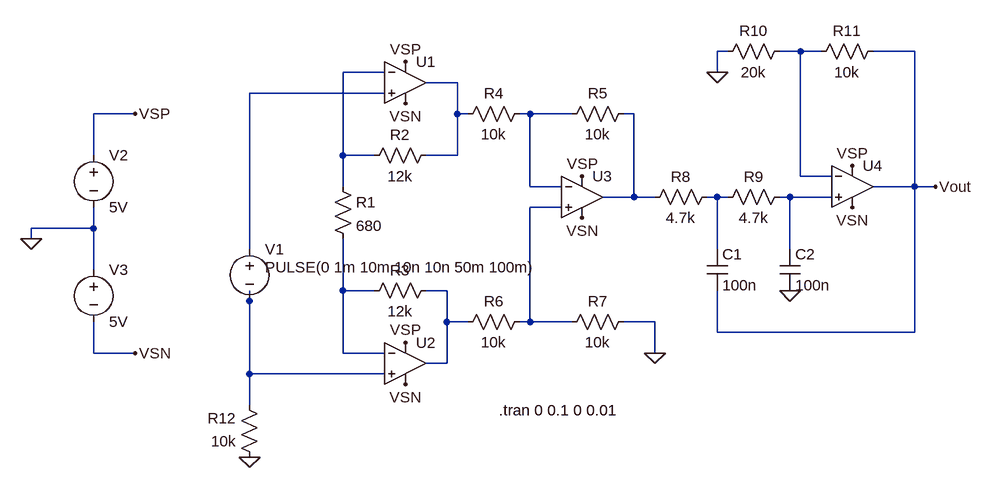
[diagram p0: schematic p.asc]
p.asc, the LTspice schematic file:
Version 4
SHEET 1 1672 680
WIRE 1280 -80 1264 -80
WIRE 1392 -80 1360 -80
WIRE 1424 -80 1392 -80
WIRE 1568 -80 1504 -80
WIRE 752 -48 688 -48
WIRE 1264 -48 1264 -80
WIRE 864 -32 816 -32
WIRE 752 -16 544 -16
WIRE 368 16 304 16
WIRE 864 16 864 -32
WIRE 880 16 864 16
WIRE 976 16 960 16
WIRE 1040 16 976 16
WIRE 1136 16 1120 16
WIRE 304 80 304 16
WIRE 688 80 688 -48
WIRE 736 80 688 80
WIRE 864 80 864 16
WIRE 864 80 816 80
WIRE 1392 112 1392 -80
WIRE 1440 112 1392 112
WIRE 688 128 688 80
WIRE 976 128 976 16
WIRE 1024 128 976 128
WIRE 1568 128 1568 -80
WIRE 1568 128 1504 128
WIRE 1600 128 1568 128
WIRE 1136 144 1136 16
WIRE 1136 144 1088 144
WIRE 1168 144 1136 144
WIRE 1264 144 1248 144
WIRE 1280 144 1264 144
WIRE 1376 144 1360 144
WIRE 1440 144 1376 144
WIRE 1024 160 976 160
WIRE 304 192 304 160
WIRE 304 192 208 192
WIRE 208 208 208 192
WIRE 544 224 544 -16
WIRE 1264 224 1264 144
WIRE 1376 224 1376 144
WIRE 304 256 304 192
WIRE 688 288 688 208
WIRE 736 288 688 288
WIRE 848 288 816 288
WIRE 544 304 544 288
WIRE 848 336 848 288
WIRE 880 336 848 336
WIRE 976 336 976 160
WIRE 976 336 960 336
WIRE 1040 336 976 336
WIRE 1168 336 1120 336
WIRE 1264 352 1264 288
WIRE 1568 352 1568 128
WIRE 1568 352 1264 352
WIRE 304 384 304 336
WIRE 368 384 304 384
WIRE 688 384 688 288
WIRE 752 384 688 384
WIRE 1168 384 1168 336
WIRE 848 400 848 336
WIRE 848 400 816 400
WIRE 544 416 544 304
WIRE 752 416 544 416
WIRE 544 464 544 416
FLAG 208 208 0
FLAG 544 544 0
FLAG 1168 384 0
FLAG 1264 -48 0
FLAG 1376 288 0
FLAG 368 16 VSP
FLAG 784 368 VSP
FLAG 784 -64 VSP
FLAG 1056 112 VSP
FLAG 1472 96 VSP
FLAG 784 432 VSN
FLAG 784 0 VSN
FLAG 368 384 VSN
FLAG 1056 176 VSN
FLAG 1472 160 VSN
FLAG 1600 128 Vout
SYMBOL voltage 544 208 R0
WINDOW 3 24 44 Left 2
WINDOW 123 24 72 Left 2
WINDOW 39 0 0 Left 0
SYMATTR Value PULSE(0 1m 10m 10n 10n 50m 100m)
SYMATTR InstName V1
SYMBOL voltage 304 64 R0
WINDOW 123 0 0 Left 0
WINDOW 39 0 0 Left 0
SYMATTR InstName V2
SYMATTR Value 5V
SYMBOL voltage 304 240 R0
WINDOW 123 0 0 Left 0
WINDOW 39 0 0 Left 0
SYMATTR InstName V3
SYMATTR Value 5V
SYMBOL Opamps\\UniversalOpamp2 784 -32 R0
SYMATTR InstName U1
SYMBOL Opamps\\UniversalOpamp2 784 400 R0
SYMATTR InstName U2
SYMBOL Opamps\\UniversalOpamp2 1056 144 R0
SYMATTR InstName U3
SYMBOL Opamps\\UniversalOpamp2 1472 128 R0
SYMATTR InstName U4
SYMBOL res 672 112 R0
SYMATTR InstName R1
SYMATTR Value 680
SYMBOL res 832 64 R90
WINDOW 0 0 56 VBottom 2
WINDOW 3 32 56 VTop 2
SYMATTR InstName R2
SYMATTR Value 12k
SYMBOL res 832 272 R90
WINDOW 0 0 56 VBottom 2
WINDOW 3 32 56 VTop 2
SYMATTR InstName R3
SYMATTR Value 12k
SYMBOL res 976 0 R90
WINDOW 0 0 56 VBottom 2
WINDOW 3 32 56 VTop 2
SYMATTR InstName R4
SYMATTR Value 10k
SYMBOL res 1136 0 R90
WINDOW 0 0 56 VBottom 2
WINDOW 3 32 56 VTop 2
SYMATTR InstName R5
SYMATTR Value 10k
SYMBOL res 976 320 R90
WINDOW 0 0 56 VBottom 2
WINDOW 3 32 56 VTop 2
SYMATTR InstName R6
SYMATTR Value 10k
SYMBOL res 1136 320 R90
WINDOW 0 0 56 VBottom 2
WINDOW 3 32 56 VTop 2
SYMATTR InstName R7
SYMATTR Value 10k
SYMBOL res 1264 128 R90
WINDOW 0 0 56 VBottom 2
WINDOW 3 32 56 VTop 2
SYMATTR InstName R8
SYMATTR Value 4.7k
SYMBOL res 1376 128 R90
WINDOW 0 0 56 VBottom 2
WINDOW 3 32 56 VTop 2
SYMATTR InstName R9
SYMATTR Value 4.7k
SYMBOL res 1376 -96 R90
WINDOW 0 0 56 VBottom 2
WINDOW 3 32 56 VTop 2
SYMATTR InstName R10
SYMATTR Value 20k
SYMBOL res 1520 -96 R90
WINDOW 0 0 56 VBottom 2
WINDOW 3 32 56 VTop 2
SYMATTR InstName R11
SYMATTR Value 10k
SYMBOL res 560 560 R180
WINDOW 0 36 76 Left 2
WINDOW 3 36 40 Left 2
SYMATTR InstName R12
SYMATTR Value 10k
SYMBOL cap 1248 224 R0
SYMATTR InstName C1
SYMATTR Value 100n
SYMBOL cap 1360 224 R0
SYMATTR InstName C2
SYMATTR Value 100n
TEXT 928 472 Left 2 !.tran 0 0.1 0 0.01

The netlist it stands for:
* p.asc
V1 N004 N012 PULSE(0 1m 10m 10n 10n 50m 100m)
V2 VSP 0 5V
V3 0 VSN 5V
XU1 N004 N002 VSP VSN N003 level.2 Avol=1Meg GBW=10Meg Slew=10Meg ilimit=25m rail=0 Vos=0 phimargin=45 en=0 enk=0 in=0 ink=0 Rin=500Meg  ; pins IN+ IN- V+ V- OUT
XU2 N012 N010 VSP VSN N011 level.2 Avol=1Meg GBW=10Meg Slew=10Meg ilimit=25m rail=0 Vos=0 phimargin=45 en=0 enk=0 in=0 ink=0 Rin=500Meg  ; pins IN+ IN- V+ V- OUT
XU3 N009 N005 VSP VSN N006 level.2 Avol=1Meg GBW=10Meg Slew=10Meg ilimit=25m rail=0 Vos=0 phimargin=45 en=0 enk=0 in=0 ink=0 Rin=500Meg  ; pins IN+ IN- V+ V- OUT
XU4 N008 N001 VSP VSN Vout level.2 Avol=1Meg GBW=10Meg Slew=10Meg ilimit=25m rail=0 Vos=0 phimargin=45 en=0 enk=0 in=0 ink=0 Rin=500Meg  ; pins IN+ IN- V+ V- OUT
R1 N002 N010 680
R2 N003 N002 12k
R3 N011 N010 12k
R4 N005 N003 10k
R5 N006 N005 10k
R6 N009 N011 10k
R7 0 N009 10k
R8 N007 N006 4.7k
R9 N008 N007 4.7k
R10 N001 0 20k
R11 Vout N001 10k
R12 0 N012 10k
C1 N007 Vout 100n
C2 N008 0 100n
.tran 0 0.1 0 0.01
.lib UniversalOpamps2.sub
.backanno
.end